# EAGLE design MagnetometerBoard-XIAO-1.0 (EAGLE 9.6.2)
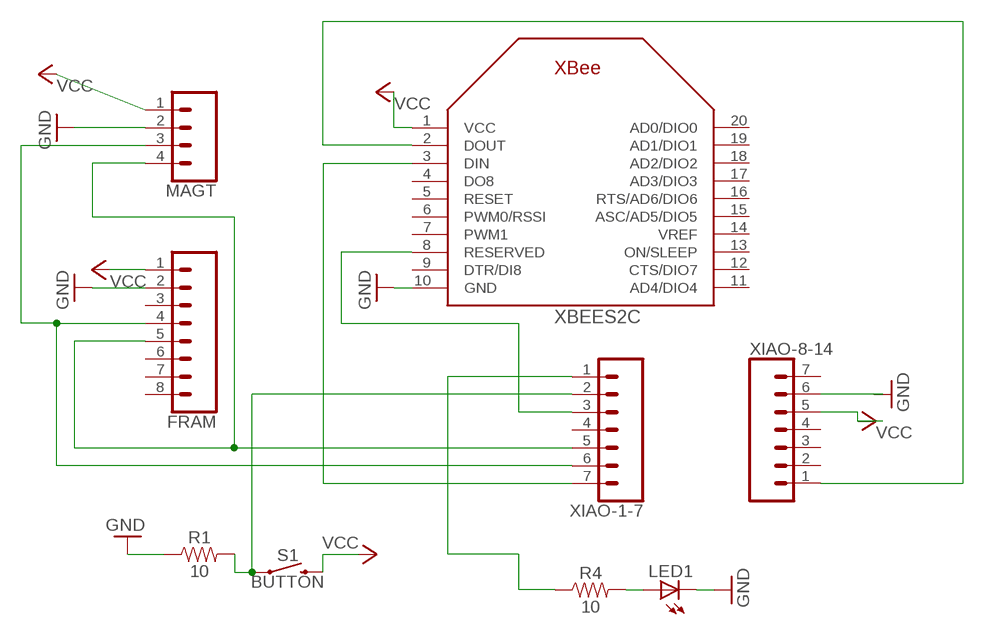
[diagram p0: schematic, sheet 1]

## Parts
FRAM  CONN_08"  [1X08]
LED1  LED3MM  [LED3MM]
MAGT  CONN_041X04_NO_SILK_NO_POP  [1X04_NO_SILK]
R1  10  10OHM-HORIZ-1/4W-1%  [AXIAL-0.3]
R4  10  10OHM-HORIZ-1/4W-1%  [AXIAL-0.3]
S1  BUTTON  MOMENTARY-SWITCH-SPST-PTH-6.0MM  [TACTILE_SWITCH_PTH_6.0MM]
XBEES2C  XBEE  [XBEE]
XIAO-1-7  CONN_07  [1X07]
XIAO-8-14  CONN_07  [1X07]

## Nets
GND: FRAM.2 LED1.K(C) MAGT.2 R1.P$1 XBEES2C.10(GND) XIAO-8-14.6
N$1: R1.P$2 S1.1 XIAO-1-7.2
N$3: XBEES2C.3(DIN) XIAO-1-7.7
N$5: XBEES2C.8(RESERVED) XIAO-1-7.3
N$6: FRAM.4 MAGT.3 XIAO-1-7.6
N$7: FRAM.5 MAGT.4 XIAO-1-7.5
N$8: LED1.A R4.P$2
N$9: XBEES2C.2(DOUT) XIAO-8-14.1
N$10: R4.P$1 XIAO-1-7.1
VCC: FRAM.1 MAGT.1 S1.3 XBEES2C.1(VCC) XIAO-8-14.5
Unconnected: FRAM.3 FRAM.6 FRAM.7 FRAM.8 XBEES2C.4(DO8) XBEES2C.5(RESET) XBEES2C.6(PWM0/RSSI) XBEES2C.7(PWM1) XBEES2C.9(DTR/DI8) XBEES2C.11(AD4/DIO4) XBEES2C.12(CTS/DIO7) XBEES2C.13(ON/SLEEP) XBEES2C.14(VREF) XBEES2C.15(ASC/AD5/DIO5) XBEES2C.16(RTS/AD6/DIO6) XBEES2C.17(AD3/DIO3) XBEES2C.18(AD2/DIO2) XBEES2C.19(AD1/DIO1) XBEES2C.20(AD0/DIO0) XIAO-1-7.4 XIAO-8-14.2 XIAO-8-14.3 XIAO-8-14.4 XIAO-8-14.7

## Library data of the parts
FRAM = SparkFun-Connectors:CONN_08: Multi connection point. Often used as Generic Header-pin footprint for 0.1 inch spaced/style header connections On any of the 0.1 inch spaced packages, you can populate with these: Break Away Headers - Straight <https://www.sparkfun.com/products/116> (PRT-00116) Break Away Male Headers - Right Angle <https://www.sparkfun.com/products/553> (PRT-00553) Female Headers <https://www.sparkfun.com/products/115> (PRT-00115) Break Away Headers - Machine Pin <https://www.sparkfun.com/products/117> (PRT-00117) Break Away Female Headers - Swiss Machine Pin <https://www.sparkfun.com/products/743> (PRT-00743) Arduino Stackable Header - 8 Pin <https://www.sparkfun.com/products/9279> (PRT-09279) For SCREWTERMINALS and SPRING TERMINALS visit here: Screw Terimnals on SparkFun.com <https://www.sparkfun.com/search/results?term=Screw+Terminals> (5mm/3.5mm/2.54mm spacing) This device is also useful as a general connection point to wire up your design to another part of your project. Our various solder wires solder well into these plated through hole pads. Hook-Up Wire - Assortment (Stranded, 22 AWG) <https://www.sparkfun.com/products/11375> (PRT-11375) Hook-Up Wire - Assortment (Solid Core, 22 AWG) <https://www.sparkfun.com/products/11367> (PRT-11367) View the entire wire category on our website here <https://www.sparkfun.com/categories/141> Special notes: Molex polarized connector foot print use with SKU : PRT-08231 with associated crimp pins and housings. 1MM SMD Version SKU: PRT-10208 NOTES ON THE VARIANTS LOCK and LOCK_LONGPADS... This footprint was designed to help hold the alignment of a through-hole component (i.e. 6-pin header) while soldering it into place. You may notice that each hole has been shifted either up or down by 0.005 of an inch from it's more standard position (which is a perfectly straight line). This slight alteration caused the pins (the squares in the middle) to touch the edges of the holes. Because they are alternating, it causes a "brace" to hold the component in place. 0.005 has proven to be the perfect amount of "off-center" position when using our standard breakaway headers. Although looks a little odd when you look at the bare footprint, once you have a header in there, the alteration is very hard to notice. Also,if you push a header all the way into place, it is covered up entirely on the bottom side.; PROD_ID: CONN-08438
LED1 = adafruit:LED: LED OSRAM: - CHIPLED LG R971, LG N971, LY N971, LG Q971, LY Q971, LO R971, LY R971 LH N974, LH R974 LS Q976, LO Q976, LY Q976 LO Q996 - Hyper CHIPLED LW Q18S LB Q993, LB Q99A, LB R99A - SideLED LS A670, LO A670, LY A670, LG A670, LP A670 LB A673, LV A673, LT A673, LW A673 LH A674 LY A675 LS A676, LA A676, LO A676, LY A676, LW A676 LS A679, LY A679, LG A679 - Hyper Micro SIDELED® LS Y876, LA Y876, LO Y876, LY Y876 LT Y87S - SmartLED LW L88C, LW L88S LB L89C, LB L89S, LG L890 LS L89K, LO L89K, LY L89K LS L896, LA L896, LO L896, LY L896 - TOPLED LS T670, LO T670, LY T670, LG T670, LP T670 LSG T670, LSP T670, LSY T670, LOP T670, LYG T670 LG T671, LOG T671, LSG T671 LB T673, LV T673, LT T673, LW T673 LH T674 LS T676, LA T676, LO T676, LY T676, LB T676, LH T676, LSB T676, LW T676 LB T67C, LV T67C, LT T67C, LS T67K, LO T67K, LY T67K, LW E67C LS E67B, LA E67B, LO E67B, LY E67B, LB E67C, LV E67C, LT E67C LW T67C LS T679, LY T679, LG T679 LS T770, LO T770, LY T770, LG T770, LP T770 LB T773, LV T773, LT T773, LW T773 LH T774 LS E675, LA E675, LY E675, LS T675 LS T776, LA T776, LO T776, LY T776, LB T776 LHGB T686 LT T68C, LB T68C - Hyper Mini TOPLED® LB M676 - Mini TOPLED Santana® LG M470 LS M47K, LO M47K, LY M47K Source: http://www.osram.convergy.de/
MAGT = SparkFun-Connectors:CONN_04: Multi connection point. Often used as Generic Header-pin footprint for 0.1 inch spaced/style header connections On any of the 0.1 inch spaced packages, you can populate with these: Break Away Headers - Straight <https://www.sparkfun.com/products/116> (PRT-00116) Break Away Male Headers - Right Angle <https://www.sparkfun.com/products/553> (PRT-00553) Female Headers <https://www.sparkfun.com/products/115> (PRT-00115) Break Away Headers - Machine Pin <https://www.sparkfun.com/products/117> (PRT-00117) Break Away Female Headers - Swiss Machine Pin <https://www.sparkfun.com/products/743> (PRT-00743) For SCREWTERMINALS and SPRING TERMINALS visit here: Screw Terimnals on SparkFun.com <https://www.sparkfun.com/search/results?term=Screw+Terminals> (5mm/3.5mm/2.54mm spacing) This device is also useful as a general connection point to wire up your design to another part of your project. Our various solder wires solder well into these plated through hole pads. Hook-Up Wire - Assortment (Stranded, 22 AWG) <https://www.sparkfun.com/products/11375> (PRT-11375) Hook-Up Wire - Assortment (Solid Core, 22 AWG) <https://www.sparkfun.com/products/11367> (PRT-11367) View the entire wire category on our website here <https://www.sparkfun.com/categories/141> Special notes: Molex polarized connector foot print use with SKU : PRT-08231 with associated crimp pins and housings. 1MM SMD Version SKU: PRT-10208
R1 R4 = SparkFun-Resistors:10OHM: 10Ω resistor A resistor is a passive two-terminal electrical component that implements electrical resistance as a circuit element. Resistors act to reduce current flow, and, at the same time, act to lower voltage levels within circuits. - Wikipedia; PROD_ID: RES-12180
S1 = SparkFun-Switches:MOMENTARY-SWITCH-SPST: Momentary Switch (Pushbutton) - SPST Normally-open (NO) SPST momentary switches (buttons, pushbuttons). Variants PTH-12MM - 12mm square, through-hole Momentary Pushbutton Switch - 12mm Square <https://www.sparkfun.com/products/9190> (COM-09190) PTH-6.0MM, PTH-6.0MM-KIT - 6.0mm square, through-hole Mini Pushbutton Switch <https://www.sparkfun.com/products/97> (COM-00097) KIT package intended for soldering kit's - only one side of pads' copper is exposed. PTH-RIGHT-ANGLE-KIT - Right-angle, through-hole Right Angle Tactile Button <https://www.sparkfun.com/products/10791> - Used on SparkFun BigTime Watch Kit <https://www.sparkfun.com/products/11734> SMD-12MM - 12mm square, surface-mount Tactile Button - SMD (12mm) <https://www.sparkfun.com/products/12993> (COM-12993) Used on SparkFun PicoBoard <https://www.sparkfun.com/products/11888> SMD-4.5MM - 4.5mm Square Trackball Switch Used on SparkFun Blackberry Trackballer Breakout <https://www.sparkfun.com/products/13169> SMD-4.6MMX2.8MM - 4.60mm x 2.80mm, surface mount Used on SparkFun SAMD21 Mini Breakout <https://www.sparkfun.com/products/13664> SMD-5.2MM, SMD-5.2-REDUNDANT - 5.2mm square, surface-mount Mini Pushbutton Switch - SMD <https://www.sparkfun.com/products/8720> (COM-08720) Used on Arduino Pro Mini <https://www.sparkfun.com/products/11114> REDUNDANT package connects both switch circuits together SMD-6.0X3.5MM - 6.0 x 3.5mm, surface mount Momentary Reset Switch SMD <https://www.sparkfun.com/products/8229> (COM-08229) SMD-6.2MM-TALL - 6.2mm square, surface mount Tactile Button - SMD (6mm) <https://www.sparkfun.com/products/12992> Used on SparkFun Digital Sandbox <https://www.sparkfun.com/products/12651> SMD-RIGHT-ANGLE - Right-angle, surface mount Used on SparkFun Block for Intel® Edison - Arduino <https://www.sparkfun.com/products/13036>; PROD_ID: SWCH-08441; SF_SKU: COM-00097
XBEES2C = adafruit:XBEE
XIAO-1-7 XIAO-8-14 = SparkFun-Connectors:CONN_07: Multi connection point. Often used as Generic Header-pin footprint for 0.1 inch spaced/style header connections On any of the 0.1 inch spaced packages, you can populate with these: Break Away Headers - Straight <https://www.sparkfun.com/products/116> (PRT-00116) Break Away Male Headers - Right Angle <https://www.sparkfun.com/products/553> (PRT-00553) Female Headers <https://www.sparkfun.com/products/115> (PRT-00115) Break Away Headers - Machine Pin <https://www.sparkfun.com/products/117> (PRT-00117) Break Away Female Headers - Swiss Machine Pin <https://www.sparkfun.com/products/743> (PRT-00743) For SCREWTERMINALS and SPRING TERMINALS visit here: Screw Terimnals on SparkFun.com <https://www.sparkfun.com/search/results?term=Screw+Terminals> (5mm/3.5mm/2.54mm spacing) This device is also useful as a general connection point to wire up your design to another part of your project. Our various solder wires solder well into these plated through hole pads. Hook-Up Wire - Assortment (Stranded, 22 AWG) <https://www.sparkfun.com/products/11375> (PRT-11375) Hook-Up Wire - Assortment (Solid Core, 22 AWG) <https://www.sparkfun.com/products/11367> (PRT-11367) View the entire wire category on our website here <https://www.sparkfun.com/categories/141> Special notes: Molex polarized connector foot print use with SKU : PRT-08231 with associated crimp pins and housings. 1MM SMD Version SKU: PRT-10208 NOTES ON THE VARIANTS LOCK and LOCK_LONGPADS... This footprint was designed to help hold the alignment of a through-hole component (i.e. 6-pin header) while soldering it into place. You may notice that each hole has been shifted either up or down by 0.005 of an inch from it's more standard position (which is a perfectly straight line). This slight alteration caused the pins (the squares in the middle) to touch the edges of the holes. Because they are alternating, it causes a "brace" to hold the component in place. 0.005 has proven to be the perfect amount of "off-center" position when using our standard breakaway headers. Although looks a little odd when you look at the bare footprint, once you have a header in there, the alteration is very hard to notice. Also,if you push a header all the way into place, it is covered up entirely on the bottom side.

## Net classes
0 default: width 0.305 mm, drill 0.508 mm, clearance 0.508 mm

## Board
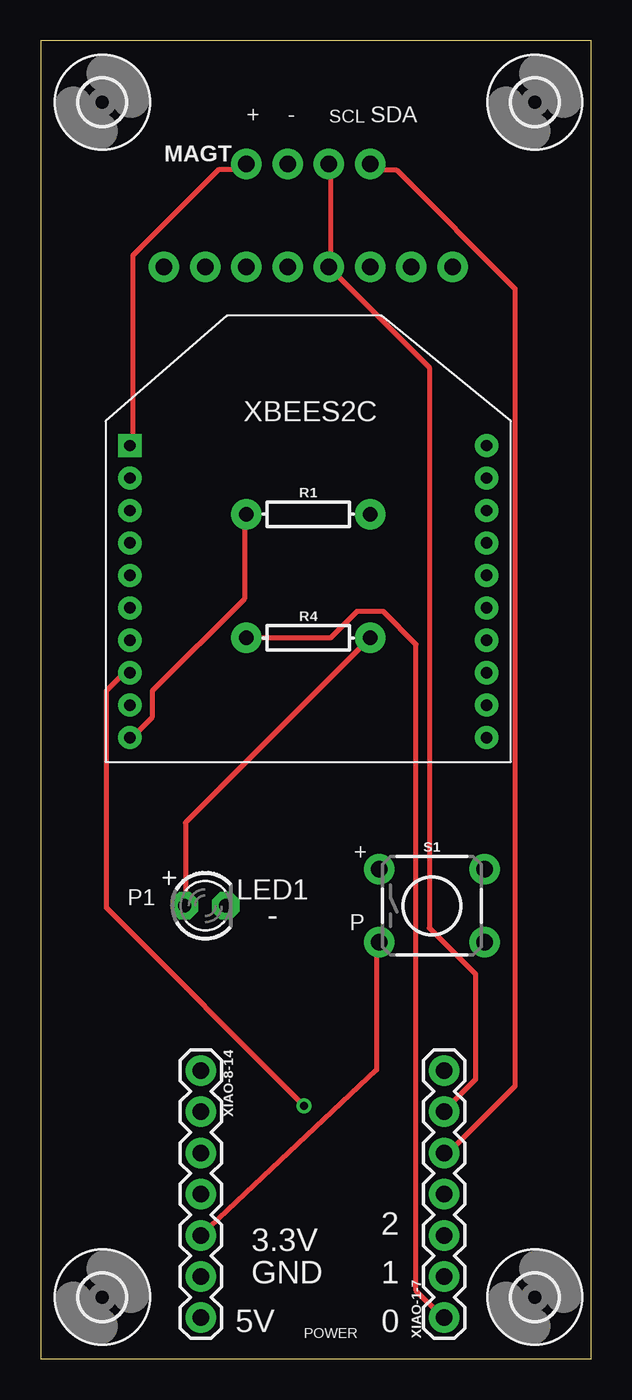
[diagram p1: board, top side]
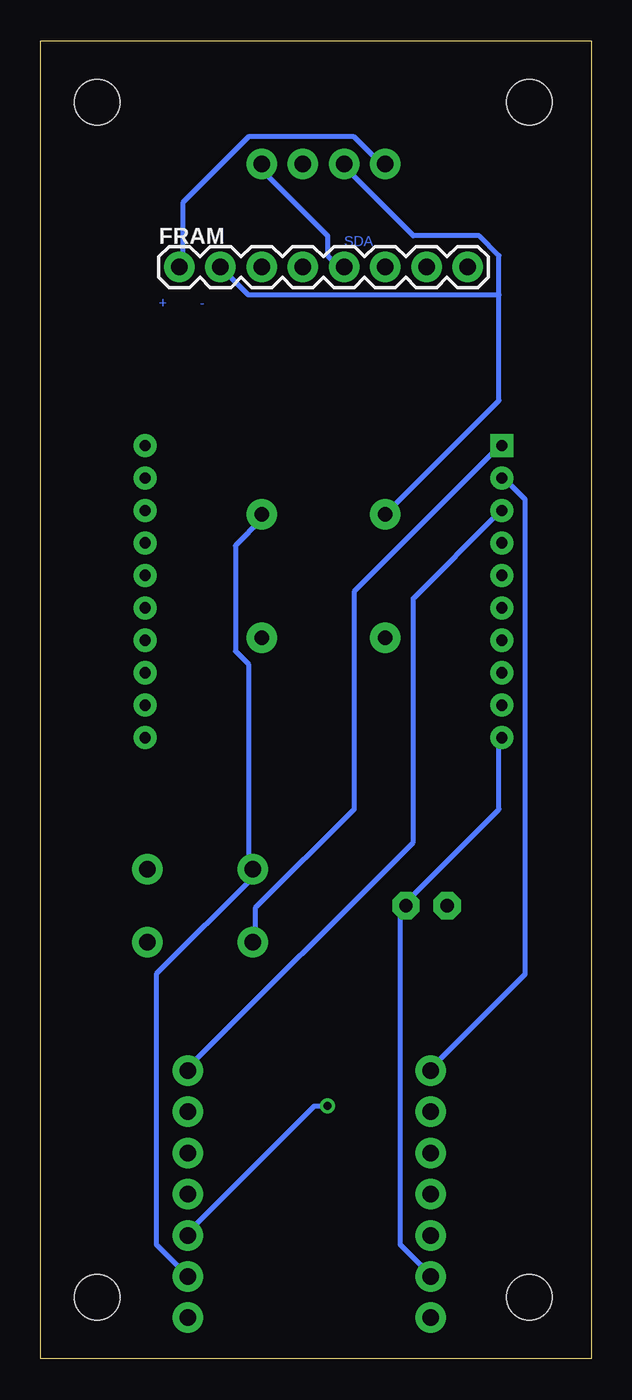
[diagram p2: board, bottom side, seen from below]

Size 33.96 x 81.27 mm. Coordinates in mm from the lower left corner, seen from the top.
Outline: 0,0 33.96,0 33.96,81.27 0,81.27 0,0
Copper layers (1*16): Top 0.035mm / dielectric 1.5mm / Bottom 0.035mm
Design rules "default": minimum track width 6mil, minimum drill 0.35mm, track to track 6mil, track to pad 6mil, pad to pad 6mil, via to via 6mil, smd to smd 6mil, copper to edge 40mil, drill to drill 6mil, minimum pad ring 10mil, minimum via ring 8mil, stop-mask expansion 4mil, vias tented up to drill 0mil, thermal gap 10mil

### Footprints (pad centres in the part's own frame; a part is rotated, then mirrored left to right if it is on the bottom)
1X08 = drill 1.016 pad 1.88: 1 0,0; 2 2.54,0; 3 5.08,0; 4 7.62,0; 5 10.16,0; 6 12.7,0; 7 15.24,0; 8 17.78,0
LED3MM = drill 0.813 pad 1.676 octagon: A -1.27,0; K 1.27,0
1X04_NO_SILK = drill 1.016 pad 1.88: 1 0,0; 2 2.54,0; 3 5.08,0; 4 7.62,0
AXIAL-0.3 = drill 0.9 pad 1.88: P$1 -3.81,0; P$2 3.81,0
TACTILE_SWITCH_PTH_6.0MM = drill 1.016 pad 1.88: 1 -3.251,2.261; 2 3.251,2.261; 3 -3.251,-2.261; 4 3.251,-2.261
2,8 = hole 2.8: 0,0
XBEE = drill 0.7 pad 1.422 square: 1 -11,5.5 | drill 0.7 pad 1.422: 2 -11,3.5; 3 -11,1.5; 4 -11,-0.5; 5 -11,-2.5; 6 -11,-4.5; 7 -11,-6.5; 8 -11,-8.5; 9 -11,-10.5; 10 -11,-12.5; 11 11,-12.5; 12 11,-10.5; 13 11,-8.5; 14 11,-6.5; 15 11,-4.5; 16 11,-2.5; 17 11,-0.5; 18 11,1.5; 19 11,3.5; 20 11,5.5
1X07 = drill 1.016 pad 1.88: 1 0,0; 2 2.54,0; 3 5.08,0; 4 7.62,0; 5 10.16,0; 6 12.7,0; 7 15.24,0

### Placement (x,y rotation side)
FRAM  25.4,67.31 0 bottom
LED1  10.16,27.94 0 top
MAGT  12.7,73.66 0 top
R1  16.51,52.07 0 top
R4  16.51,44.45 0 top
S1  24.13,27.94 0 top
U$1  [2,8]  3.81,77.47 0 top
U$2  [2,8]  30.48,77.47 0 top
U$3  [2,8]  3.81,3.81 0 top
U$4  [2,8]  30.48,3.81 0 top
XBEES2C  16.51,50.8 0 top
XIAO-1-7  24.89,2.54 90 top
XIAO-8-14  9.89,17.78 270 top

### Tracks (layer width: path | path; a pad name or v marks a point on that pad's centre or on a via)
GND
  Top 0.305: R1.P$1 12.6,51.77 12.6,46.89 6.91,41.2 6.91,39.57 5.69,38.35 XBEES2C.10
  Bottom 0.305: XBEES2C.10 5.69,37.95 5.69,33.88 11.38,28.19 LED1.K 11.79,27.79 11.79,7.06 10.16,5.44 XIAO-8-14.6 | 5.69,65.58 5.69,59.08 R1.P$1 | 5.69,65.58 5.69,68.02 6.91,69.24 10.97,69.24 15.04,73.3 MAGT.2 | FRAM.2 21.13,65.58 5.69,65.58
N$1
  Bottom 0.305: R1.P$2 20.32,51.77 21.95,50.14 21.95,43.64 21.13,42.82 21.13,30.23 S1.1 20.73,29.82 26.82,23.72 26.82,7.06 25.2,5.44 XIAO-1-7.2
N$3
  Bottom 0.305: XBEES2C.3 5.69,52.17 10.97,46.89 10.97,31.85 24.79,18.03 XIAO-1-7.7
N$5  (via drill 0.51)
  Top 0.305: v16.26,15.6 4.06,27.79 4.06,41.2 4.88,42.01 5.28,42.01 XBEES2C.8
  Bottom 0.305: v16.26,15.6 17.07,15.6 24.79,7.87 XIAO-1-7.3
N$6
  Top 0.305: MAGT.3 17.88,73.3 17.88,67.62 FRAM.4 23.98,61.11 23.98,26.57 26.82,23.72 26.82,17.22 25.2,15.6 XIAO-1-7.6
N$7
  Top 0.305: XIAO-1-7.5 25.2,12.75 29.26,16.81 29.26,65.99 21.95,73.3 20.32,73.3 MAGT.4
  Bottom 0.305: FRAM.5 15.44,67.62 15.85,67.62 16.26,68.02 16.26,69.24 20.32,73.3 MAGT.4
N$8
  Top 0.305: R4.P$2 8.94,33.07 8.94,28.19 LED1.A
N$9
  Bottom 0.305: XBEES2C.2 5.28,54.2 4.06,52.98 4.06,23.72 9.75,18.03 XIAO-8-14.1
N$10
  Top 0.305: R4.P$1 17.88,44.45 19.51,46.08 21.13,46.08 23.16,44.04 23.16,4.22 24.79,2.59 XIAO-1-7.1
VCC
  Top 0.305: XIAO-8-14.5 20.73,17.81 20.73,25.35 S1.3 | XBEES2C.1 5.69,56.64 5.69,68.02 10.97,73.3 12.6,73.3 MAGT.1
  Bottom 0.305: FRAM.1 25.2,67.62 25.2,71.27 21.13,75.34 14.63,75.34 13.01,73.71 MAGT.1 | S1.3 20.73,25.76 20.73,27.79 14.63,33.88 14.63,47.3 5.69,56.24 XBEES2C.1

### Text on the board
Bottom: SDA | - | +
tNames: + | - | SCL | SDA | + | P1 | - | P | 2 | 3.3V | GND | 1 | 5V | POWER | 0